# EAGLE design brakelight (EAGLE 6.3)
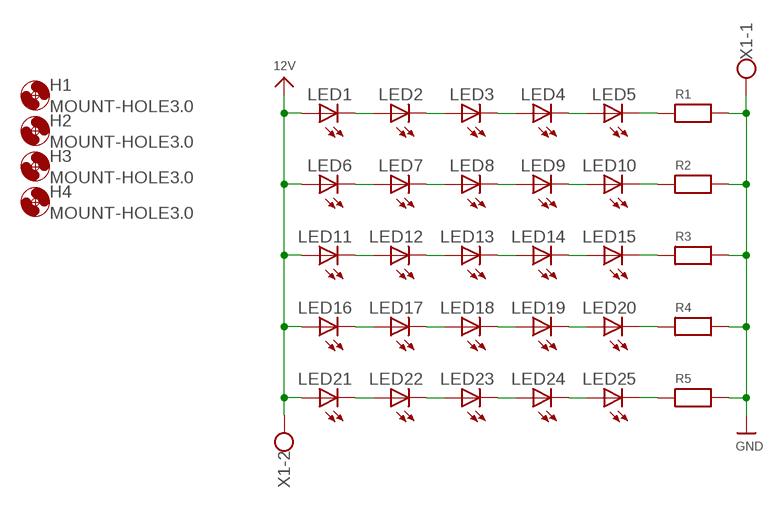
[diagram p0: schematic, sheet 1]

## Parts
H1  MOUNT-HOLE3.0  [3,0]
H2  MOUNT-HOLE3.0  [3,0]
H3  MOUNT-HOLE3.0  [3,0]
H4  MOUNT-HOLE3.0  [3,0]
LED1  LEDP-LCC-2  [P-LCC-2]
LED2  LEDP-LCC-2  [P-LCC-2]
LED3  LEDP-LCC-2  [P-LCC-2]
LED4  LEDP-LCC-2  [P-LCC-2]
LED5  LEDP-LCC-2  [P-LCC-2]
LED6  LEDP-LCC-2  [P-LCC-2]
LED7  LEDP-LCC-2  [P-LCC-2]
LED8  LEDP-LCC-2  [P-LCC-2]
LED9  LEDP-LCC-2  [P-LCC-2]
LED10  LEDP-LCC-2  [P-LCC-2]
LED11  LEDP-LCC-2  [P-LCC-2]
LED12  LEDP-LCC-2  [P-LCC-2]
LED13  LEDP-LCC-2  [P-LCC-2]
LED14  LEDP-LCC-2  [P-LCC-2]
LED15  LEDP-LCC-2  [P-LCC-2]
LED16  LEDP-LCC-2  [P-LCC-2]
LED17  LEDP-LCC-2  [P-LCC-2]
LED18  LEDP-LCC-2  [P-LCC-2]
LED19  LEDP-LCC-2  [P-LCC-2]
LED20  LEDP-LCC-2  [P-LCC-2]
LED21  LEDP-LCC-2  [P-LCC-2]
LED22  LEDP-LCC-2  [P-LCC-2]
LED23  LEDP-LCC-2  [P-LCC-2]
LED24  LEDP-LCC-2  [P-LCC-2]
LED25  LEDP-LCC-2  [P-LCC-2]
R1  RESISTOR0805  [0805]
R2  RESISTOR0805  [0805]
R3  RESISTOR0805  [0805]
R4  RESISTOR0805  [0805]
R5  RESISTOR0805  [0805]
X1  W237-102  [W237-102]

## Nets
12V: LED1.A LED6.A LED11.A LED16.A LED21.A X1.2
GND: R1.2 R2.2 R3.2 R4.2 R5.2 X1.1
N$1: LED1.C LED2.A
N$2: LED6.C LED7.A
N$3: LED11.C LED12.A
N$4: LED16.C LED17.A
N$5: LED21.C LED22.A
N$6: LED2.C LED3.A
N$7: LED7.C LED8.A
N$8: LED12.C LED13.A
N$9: LED17.C LED18.A
N$10: LED22.C LED23.A
N$11: LED3.C LED4.A
N$12: LED8.C LED9.A
N$13: LED13.C LED14.A
N$14: LED18.C LED19.A
N$15: LED23.C LED24.A
N$16: LED4.C LED5.A
N$17: LED9.C LED10.A
N$18: LED14.C LED15.A
N$19: LED19.C LED20.A
N$20: LED24.C LED25.A
N$21: LED5.C R1.1
N$22: LED10.C R2.1
N$23: LED15.C R3.1
N$24: LED20.C R4.1
N$25: LED25.C R5.1

## Library data of the parts
H1-H4 = holes:MOUNT-HOLE: MOUNTING HOLE with drill center marker
LED1-LED25 = adafruit:LED: LED OSRAM: - CHIPLED LG R971, LG N971, LY N971, LG Q971, LY Q971, LO R971, LY R971 LH N974, LH R974 LS Q976, LO Q976, LY Q976 LO Q996 - Hyper CHIPLED LW Q18S LB Q993, LB Q99A, LB R99A - SideLED LS A670, LO A670, LY A670, LG A670, LP A670 LB A673, LV A673, LT A673, LW A673 LH A674 LY A675 LS A676, LA A676, LO A676, LY A676, LW A676 LS A679, LY A679, LG A679 - Hyper Micro SIDELED® LS Y876, LA Y876, LO Y876, LY Y876 LT Y87S - SmartLED LW L88C, LW L88S LB L89C, LB L89S, LG L890 LS L89K, LO L89K, LY L89K LS L896, LA L896, LO L896, LY L896 - TOPLED LS T670, LO T670, LY T670, LG T670, LP T670 LSG T670, LSP T670, LSY T670, LOP T670, LYG T670 LG T671, LOG T671, LSG T671 LB T673, LV T673, LT T673, LW T673 LH T674 LS T676, LA T676, LO T676, LY T676, LB T676, LH T676, LSB T676, LW T676 LB T67C, LV T67C, LT T67C, LS T67K, LO T67K, LY T67K, LW E67C LS E67B, LA E67B, LO E67B, LY E67B, LB E67C, LV E67C, LT E67C LW T67C LS T679, LY T679, LG T679 LS T770, LO T770, LY T770, LG T770, LP T770 LB T773, LV T773, LT T773, LW T773 LH T774 LS E675, LA E675, LY E675, LS T675 LS T776, LA T776, LO T776, LY T776, LB T776 LHGB T686 LT T68C, LB T68C - Hyper Mini TOPLED® LB M676 - Mini TOPLED Santana® LG M470 LS M47K, LO M47K, LY M47K Source: http://www.osram.convergy.de/
R1-R5 = microbuilder:RESISTOR: Resistors 0402 - 0402 Surface Mount Package 22 Ohm 1% 1/16W [Digikey: 311-22.0LRTR-ND] 33 Ohm 5% 1/16W 1.0K 5% 1/16W 1.5K 5% 1/16W 2.0K 1% 1/16W 10.0K 1% 1/16W [Digikey: 311-10.0KLRTR-ND] 10.0K 5% 1/16W [Digikey: RMCF0402JT10K0TR-ND] 12.1K 1% 1/16W [Digikey: 311-22.0LRTR-ND] 100.0K 5% 1/16W 0603 - 0603 Surface Mount Package 0 Ohm 1/10 Watt 1% Resistor 15 Ohm 1/10 Watt 1% Resistor 33 Ohm 1/10 Watt 1% Resistor 49.9 Ohm 1/10 Watt 1% Resistor 100 Ohm 1/10 Watt 1% Resistor 150 Ohm 1/10 Watt 1% Resistor 240 Ohm 1/10 Watt 1% Resistor 390 Ohm 1/10 Watt 1% Resistor 560 Ohm 1/10 Watt 1% Resistor 680 Ohm 1/10 Watt 1% Resistor 750 Ohm 1/10 Watt 1% Resistor 1.0K Ohm 1/10 Watt 1% Resistor 1.5K Ohm 1/10 Watt 1% Resistor 2.0K Ohm 1/10 Watt 1% Resistor 2.2K Ohm 1/10 Watt 1% Resistor 3.3K Ohm 1/10 Watt 1% Resistor 4.7K Ohm 1/10 Watt 1% Resistor 10.0K Ohm 1/10 Watt 1% Resistor 12.0K Ohm 1/10 Watt 1% Resistor 12.1K Ohm 1/10 Watt 1% Resistor 20.0K Ohm 1/10 Watt 1% Resistor 33.0K Ohm 1/10 Watt 1% Resistor 100.0K Ohm 1/10 Watt 1% Resistor 0805 - 0805 Surface Mount Package 0 Ohm 1/8 Watt 1% Resistor 33 Ohm 1/8 Watt 1% Resistor 100 Ohm 1/8 Watt 1% Resistor 150 Ohm 1/8 Watt 1% Resistor 200 Ohm 1/8 Watt 1% Resistor 240 Ohm 1/8 Watt 1% Resistor 330 Ohm 1/8 Watt 1% Resistor 390 Ohm 1/8 Watt 1% Resistor 470 Ohm 1/8 Watt 1% Resistor 1.0K Ohm 1/8 Watt 1% Resistor 1.5K Ohm 1/8 Watt 1% Resistor 2.0K Ohm 1/8 Watt 1% Resistor 4.7K Ohm 1/8 Watt 1% Resistor 5.1K Ohm 1/8 Watt 1% Resistor 5.6K Ohm 1/8 Watt 1% Resistor 10.0K Ohm 1/8 Watt 1% Resistor 22.0K Ohm 1/8 Watt 1% Resistor 33.0K Ohm 1/8 Watt 1% Resistor 100K Ohm 1/8 Watt 1% Resistor 1206 - 1206 Surface Mount Package 2012 - 2010 Surface Mount Package 0.11 Ohm 1/2 Watt 1% Resistor - Digikey: RHM.11UCT-ND
X1 = con-wago-500:W237-102: WAGO SCREW CLAMP; MPN: 237-102; OC_FARNELL: unknown; OC_NEWARK: 70K9898

## Board
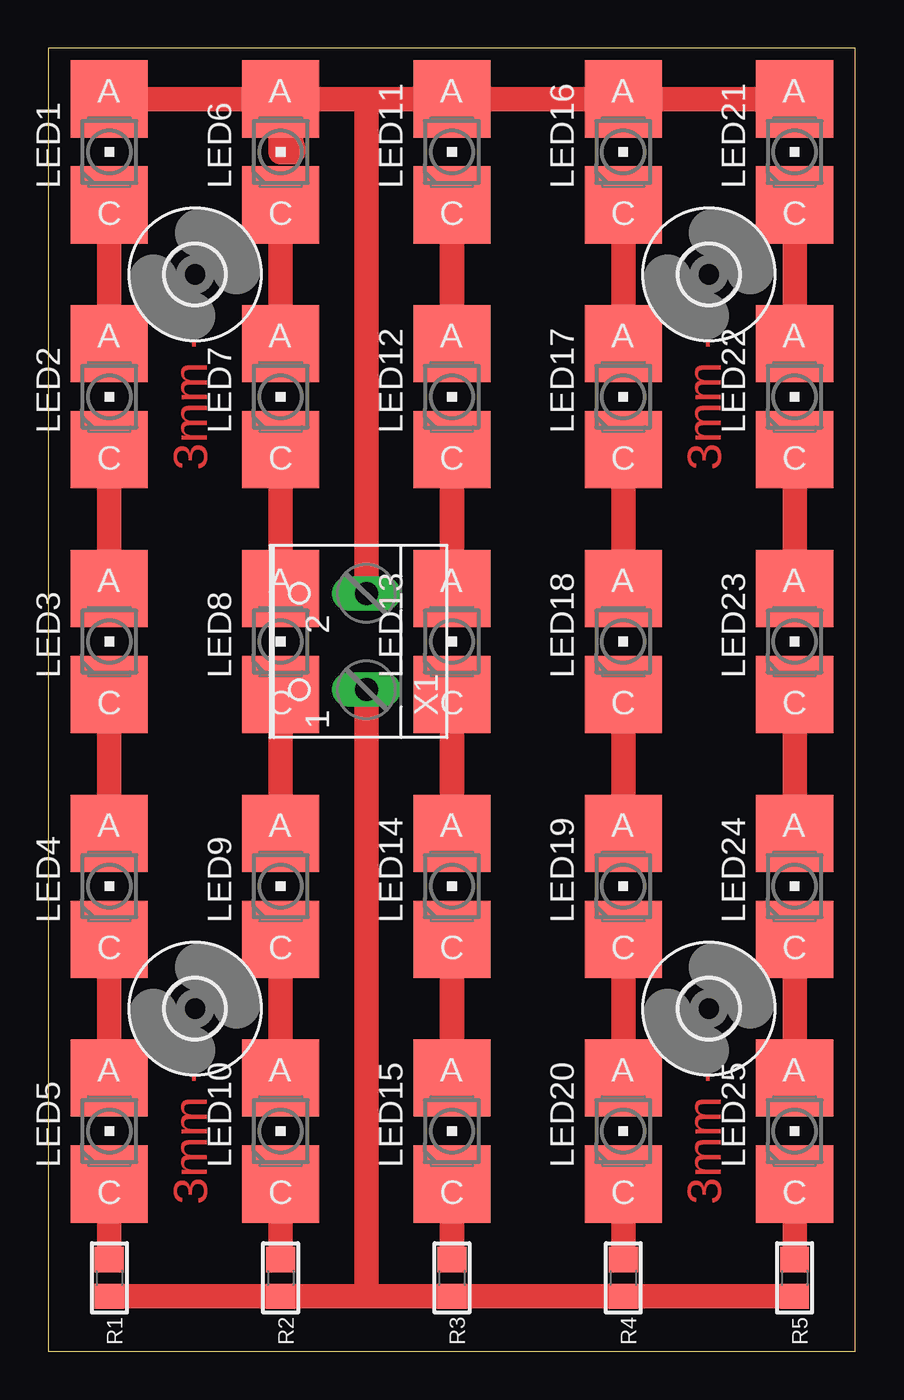
[diagram p1: board, top side]

Size 41.89 x 67.61 mm. Coordinates in mm from the lower left corner, seen from the top.
Outline: 0,0 41.89,0 41.89,67.61 0,67.61 0,0
Copper layers (1*16): Top 0.035mm / dielectric 1.5mm / Bottom 0.035mm
Design rules "default": minimum track width 10mil, minimum drill 24mil, track to track 8mil, track to pad 8mil, pad to pad 8mil, via to via 8mil, smd to smd 8mil, copper to edge 40mil, drill to drill 8mil, minimum pad ring 10mil, minimum via ring 8mil, stop-mask expansion 4mil, vias tented up to drill 0mil, thermal gap 10mil

### Footprints (pad centres in the part's own frame; a part is rotated, then mirrored left to right if it is on the bottom)
3,0 = hole 3: 0,0
P-LCC-2 = smd 4 x 4: A 0,2.75; C 0,-2.75
0805 = smd 1.3 x 1.5: 1 -0.95,0; 2 0.95,0
W237-102 = drill 1.194 long: 1 -2.5,-1.27; 2 2.5,-1.27

### Placement (x,y rotation side)
H1  7.62,55.88 0 top
H2  34.29,55.88 0 top
H3  7.62,17.78 0 top
H4  34.29,17.78 0 top
LED1  3.17,62.23 0 top
LED2  3.17,49.53 0 top
LED3  3.17,36.83 0 top
LED4  3.17,24.13 0 top
LED5  3.17,11.43 0 top
LED6  12.06,62.23 0 top
LED7  12.06,49.53 0 top
LED8  12.06,36.83 0 top
LED9  12.06,24.13 0 top
LED10  12.06,11.43 0 top
LED11  20.95,62.23 0 top
LED12  20.95,49.53 0 top
LED13  20.95,36.83 0 top
LED14  20.95,24.13 0 top
LED15  20.95,11.43 0 top
LED16  29.84,62.23 0 top
LED17  29.84,49.53 0 top
LED18  29.84,36.83 0 top
LED19  29.84,24.13 0 top
LED20  29.84,11.43 0 top
LED21  38.73,62.23 0 top
LED22  38.73,49.53 0 top
LED23  38.73,36.83 0 top
LED24  38.73,24.13 0 top
LED25  38.73,11.43 0 top
R1  3.17,3.81 270 top
R2  12.06,3.81 270 top
R3  20.95,3.81 270 top
R4  29.84,3.81 270 top
R5  38.73,3.81 270 top
X1  15.24,36.83 90 top

### Tracks (layer width: path | path; a pad name or v marks a point on that pad's centre or on a via)
12V
  Top 1.27: LED1.A LED6.A | LED6.A 12.7,62.44 12.7,62.23 12.06,62.23 LED6.A | LED6.A 16.51,64.98 | 16.51,64.98 LED11.A LED16.A LED21.A | X1.2 16.51,64.98
GND
  Top 1.27: R1.2 R2.2 16.51,2.86 | 16.51,2.86 R3.2 R4.2 R5.2 | X1.1 16.51,2.86
N$1
  Top 1.27: LED1.C LED2.A
N$2
  Top 1.27: LED6.C LED7.A
N$3
  Top 1.27: LED11.C LED12.A
N$4
  Top 1.27: LED16.C LED17.A
N$5
  Top 1.27: LED21.C LED22.A
N$6
  Top 1.27: LED2.C LED3.A
N$7
  Top 1.27: LED7.C LED8.A
N$8
  Top 1.27: LED12.C LED13.A
N$9
  Top 1.27: LED17.C LED18.A
N$10
  Top 1.27: LED22.C LED23.A
N$11
  Top 1.27: LED3.C LED4.A
N$12
  Top 1.27: LED8.C LED9.A
N$13
  Top 1.27: LED13.C LED14.A
N$14
  Top 1.27: LED18.C LED19.A
N$15
  Top 1.27: LED23.C LED24.A
N$16
  Top 1.27: LED4.C LED5.A
N$17
  Top 1.27: LED9.C LED10.A
N$18
  Top 1.27: LED14.C LED15.A
N$19
  Top 1.27: LED19.C LED20.A
N$20
  Top 1.27: LED24.C LED25.A
N$21
  Top 1.27: R1.1 LED5.C
N$22
  Top 1.27: R2.1 LED10.C
N$23
  Top 1.27: R3.1 LED15.C
N$24
  Top 1.27: R4.1 LED20.C
N$25
  Top 1.27: LED25.C R5.1
N$26  (via drill 1.1)
  other vias: 7.62,17.78
N$27  (via drill 1.1)
  other vias: 34.29,17.78
N$28  (via drill 1.1)
  other vias: 7.62,55.88
N$29  (via drill 1.1)
  other vias: 34.29,55.88

### Text on the board
Top: 3mm -> | 3mm -> | 3mm -> | 3mm ->